# Altium schematic sheet v1.0.SchDoc
size 83 x 40 mm
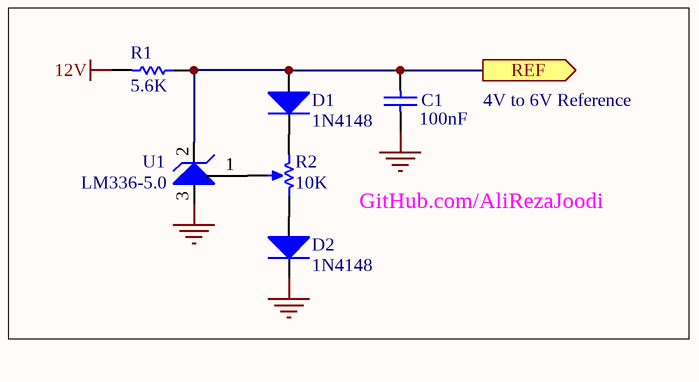
[diagram p0: v1.0.SchDoc]

## Parts
C1  value 100nF  [CAPNTO2.54-3.05x1.78A]  (hidden comment: Cap)
D1  1N4148  [DIODE0.4_Glass]
D2  1N4148  [DIODE0.4_Glass]
R1  value 5.6K  [AXIAL-0.4]  (hidden comment: Res1)
R2  value 10K  [VR4_]  (hidden comment: POT)
U1  LM336-5.0  [TO92C]

## Ports
REF (out)

## Nets
12V: R1.2
GND: C1.2 D2.2(K) U1.3(-)
REF: C1.1 D1.1(A) R1.1 U1.2(+) ; port REF
NetD1_2: D1.2(K) R2.2(BOT)
NetD2_1: D2.1(A) R2.1(TOP)
NetR2_3: R2.3(TAP) U1.1(Adj)

## Notes on the sheet
- 4V to 6V Reference
- GitHub.com/AliRezaJoodi

## Library data of the parts
C1 = Cap: Capacitor; Manufacturer: Generic Components; Class I: Passive; Published: 8-Jun-2000; Revision: July-2002: Re-released for DXP Platform.; Publisher: Altium Limited; Class II: Capacitor
D1 D2 = Diode: Default Diode; Manufacturer: Generic Components; Class I: Discrete; Class II: Diode - Switching; Published: 8-Jun-2000; Revision: July-2002: Re-released for DXP Platform.; Publisher: Altium Limited
R1 = Res1: Resistor; Published: 8-Jun-2000; LatestRevisionDate: 17-Jul-2002; LatestRevisionNote: Re-released for DXP Platform.; PackageReference: AXIAL-0.3; Publisher: Altium Limited
R2 = RPot1: Potentiometer; Manufacturer: Generic Components; Class I: Passive; Set Position: 0.5; Published: 8-Jun-2000; Revision: July-2002: Re-released for DXP Platform.; Publisher: Altium Limited; Class II: Potentiometer
U1 = LM336: Programmable Shunt Regulator; Value: +5V; Revision: July-2002: Re-released for DXP Platform.